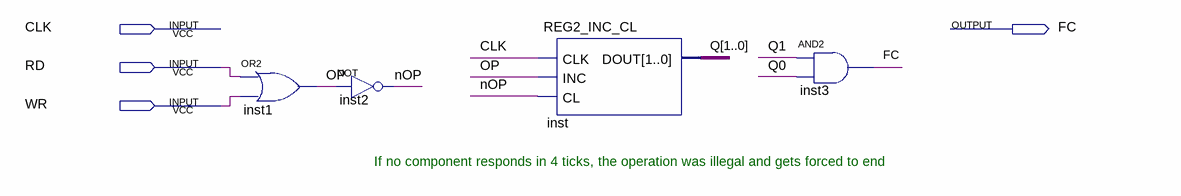
[diagram p0: schematic sheet]
// Quartus schematic Watchdog.bdf as structural Verilog: 4 symbols, 4 pins
module Watchdog (
  input  CLK,
  input  RD,
  input  WR,
  output FC
);

  wire nOP, OP;
  wire [1:0] Q;

  or inst1 (OP, RD, WR);
  not inst2 (nOP, OP);
  REG2_INC_CL inst (.CLK(CLK), .INC(OP), .CL(nOP), .DOUT(Q));
  and inst3 (FC, Q[1], Q[0]);

  // Notes on the sheet:
  //   If no component responds in 4 ticks, the operation was illegal and gets forced to end
endmodule
